# Altium schematic sheet YQYtest.SchDoc
size A4
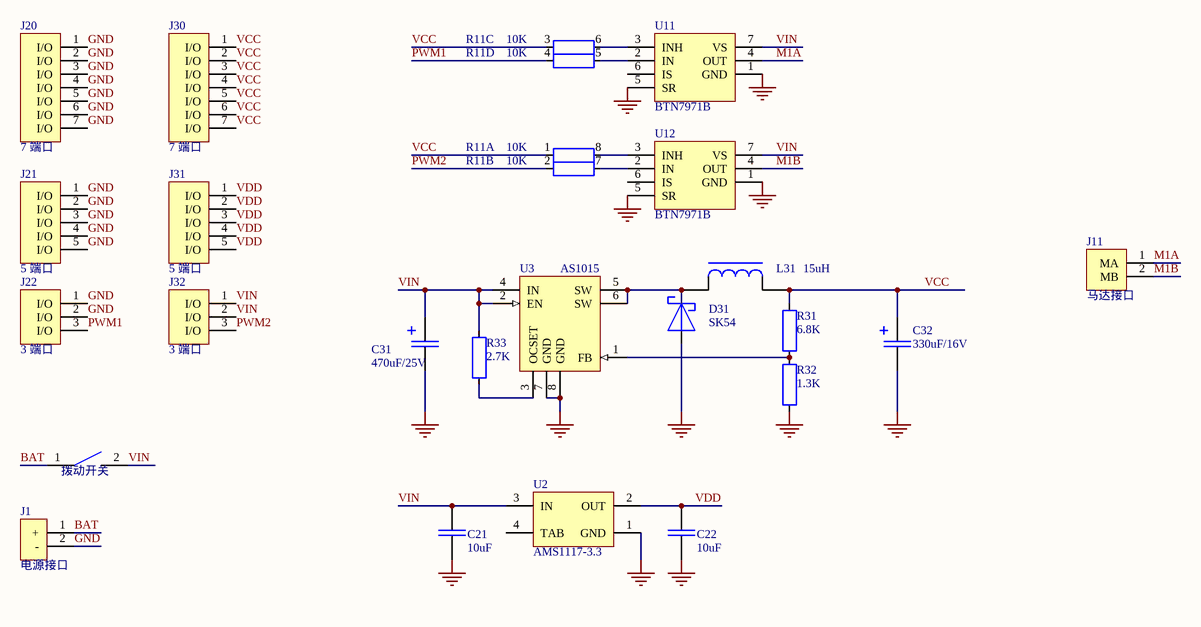
[diagram p0: YQYtest.SchDoc]

## Parts
C21  10uF  [0805]
C22  10uF  [0805]
C31  470uF/25V  [CAPPR0.19]
C32  330uF/16V  [CAPPR0.19]
D31  SK54  [SMC/DO-214AB]
J1  电源接口  [DC12V]
J11  马达接口  [MOTOR-W]
J20  7 端口  [SIP7]
J21  5 端口  [SIP5]
J22  3 端口  [SIP3]
J30  7 端口  [SIP7]
J31  5 端口  [SIP5]
J32  3 端口  [SIP3]
L31  15uH  [4040电感]
R11  10K  [PZ-4]  (parts A,B,C,D of 4)
R31  6.8K  [0805]
R32  1.3K  [0805]
R33  2.7K  [0805]
U2  AMS1117-3.3  [MP04A_M]
U3  AS1015  [SOP8_M]
U11  BTN7971B  [TO263-7-1]
U12  BTN7971B  [TO263-7-1]
拨动开关  开关  [5A120V开关]  (value not drawn)

## Nets
GND: C21.2 C22.2 C31.2 C32.2 D31.1(A) J1.2(-) J20.1(I/O) J20.2(I/O) J20.3(I/O) J20.4(I/O) J20.5(I/O) J20.6(I/O) J20.7(I/O) J21.1(I/O) J21.2(I/O) J21.3(I/O) J21.4(I/O) J21.5(I/O) J22.1(I/O) J22.2(I/O) R32.1 U2.1(GND) U3.7(GND) U3.8(GND) U11.1(GND) U11.5(SR) U12.1(GND) U12.5(SR)
BAT: J1.1(+) 拨动开关.1
M1A: J11.1(MA) U11.4(OUT)
M1B: J11.2(MB) U12.4(OUT)
PWM1: J22.3(I/O) R11.4
PWM2: J32.3(I/O) R11.2
VCC: C32.1 J30.1(I/O) J30.2(I/O) J30.3(I/O) J30.4(I/O) J30.5(I/O) J30.6(I/O) J30.7(I/O) L31.2 R11.1 R11.3 R31.2
VDD: C22.1 J31.1(I/O) J31.2(I/O) J31.3(I/O) J31.4(I/O) J31.5(I/O) U2.2(OUT)
VIN: C21.1 C31.1 J32.1(I/O) J32.2(I/O) R33.2 U2.3(IN) U3.2(EN) U3.4(IN) U11.7(VS) U12.7(VS) 拨动开关.2
NetD31_2: D31.2(K) L31.1 U3.5(SW) U3.6(SW)
NetR11_5: R11.5 U11.2(IN)
NetR11_6: R11.6 U11.3(INH)
NetR11_7: R11.7 U12.2(IN)
NetR11_8: R11.8 U12.3(INH)
NetR31_1: R31.1 R32.2 U3.1(FB)
NetR33_1: R33.1 U3.3(OCSET)

Not connected (* = marked no-connect by the designer): U2 4(TAB); U11 6(IS); U12 6(IS)

## Library data of the parts
C21 C22 = C
C31 C32 = C+
D31 = D
L31 = L
R11 = Res Pack: Isolated Resistor Network - Parts
R31-R33 = R
U2 = LM1117MP-3.3: 800mA Low-Dropout Linear Regulator; Manufacturer: National Semiconductor; CompType: LDO IC; PackageTopMarking: XYTT*N05A; PowerWise: N; Published: 4-Dec-2008; DatasheetVersion: Apr-2006; PackageVersion: revB, Apr-2003; PackageReference: MP04A; Publisher: Altium Limited; PackageDescription: Molded SOT-223, 6.50 x 3.56 x 1.6mm Body, 4 Lead, 2.3mm Pitch; PartNumber: LM1117MP-3.3; RoHS: O; PinCount: 4; DigiKeyPartNumber: LM1117MP-3.3CT-ND; Code_JEDEC: TO-261-AA; Code_IPC: SOT223-4; ComponentLink1Description: LM1117 Datasheet; ComponentLink1URL: http://www.national.com/ds/LM/LM1117.pdf; ComponentLink2Description: LM1117 Web Page; ComponentLink2URL: http://www.national.com/pf/LM/LM1117.html; ComponentLink3Description: MP04A Package Page; ComponentLink3URL: http://www.national.com/packaging/folders/mp04a.html
拨动开关 = 开关: Published: 24-Mar-1999; LatestRevisionDate: 17-Dec-2003; LatestRevisionNote: Schematic revised, PCB Footprint replaced.; DatasheetDocument: 05-Dec-2000; Publisher: Altium Limited